# Altium project PCBLaser.PrjPCB
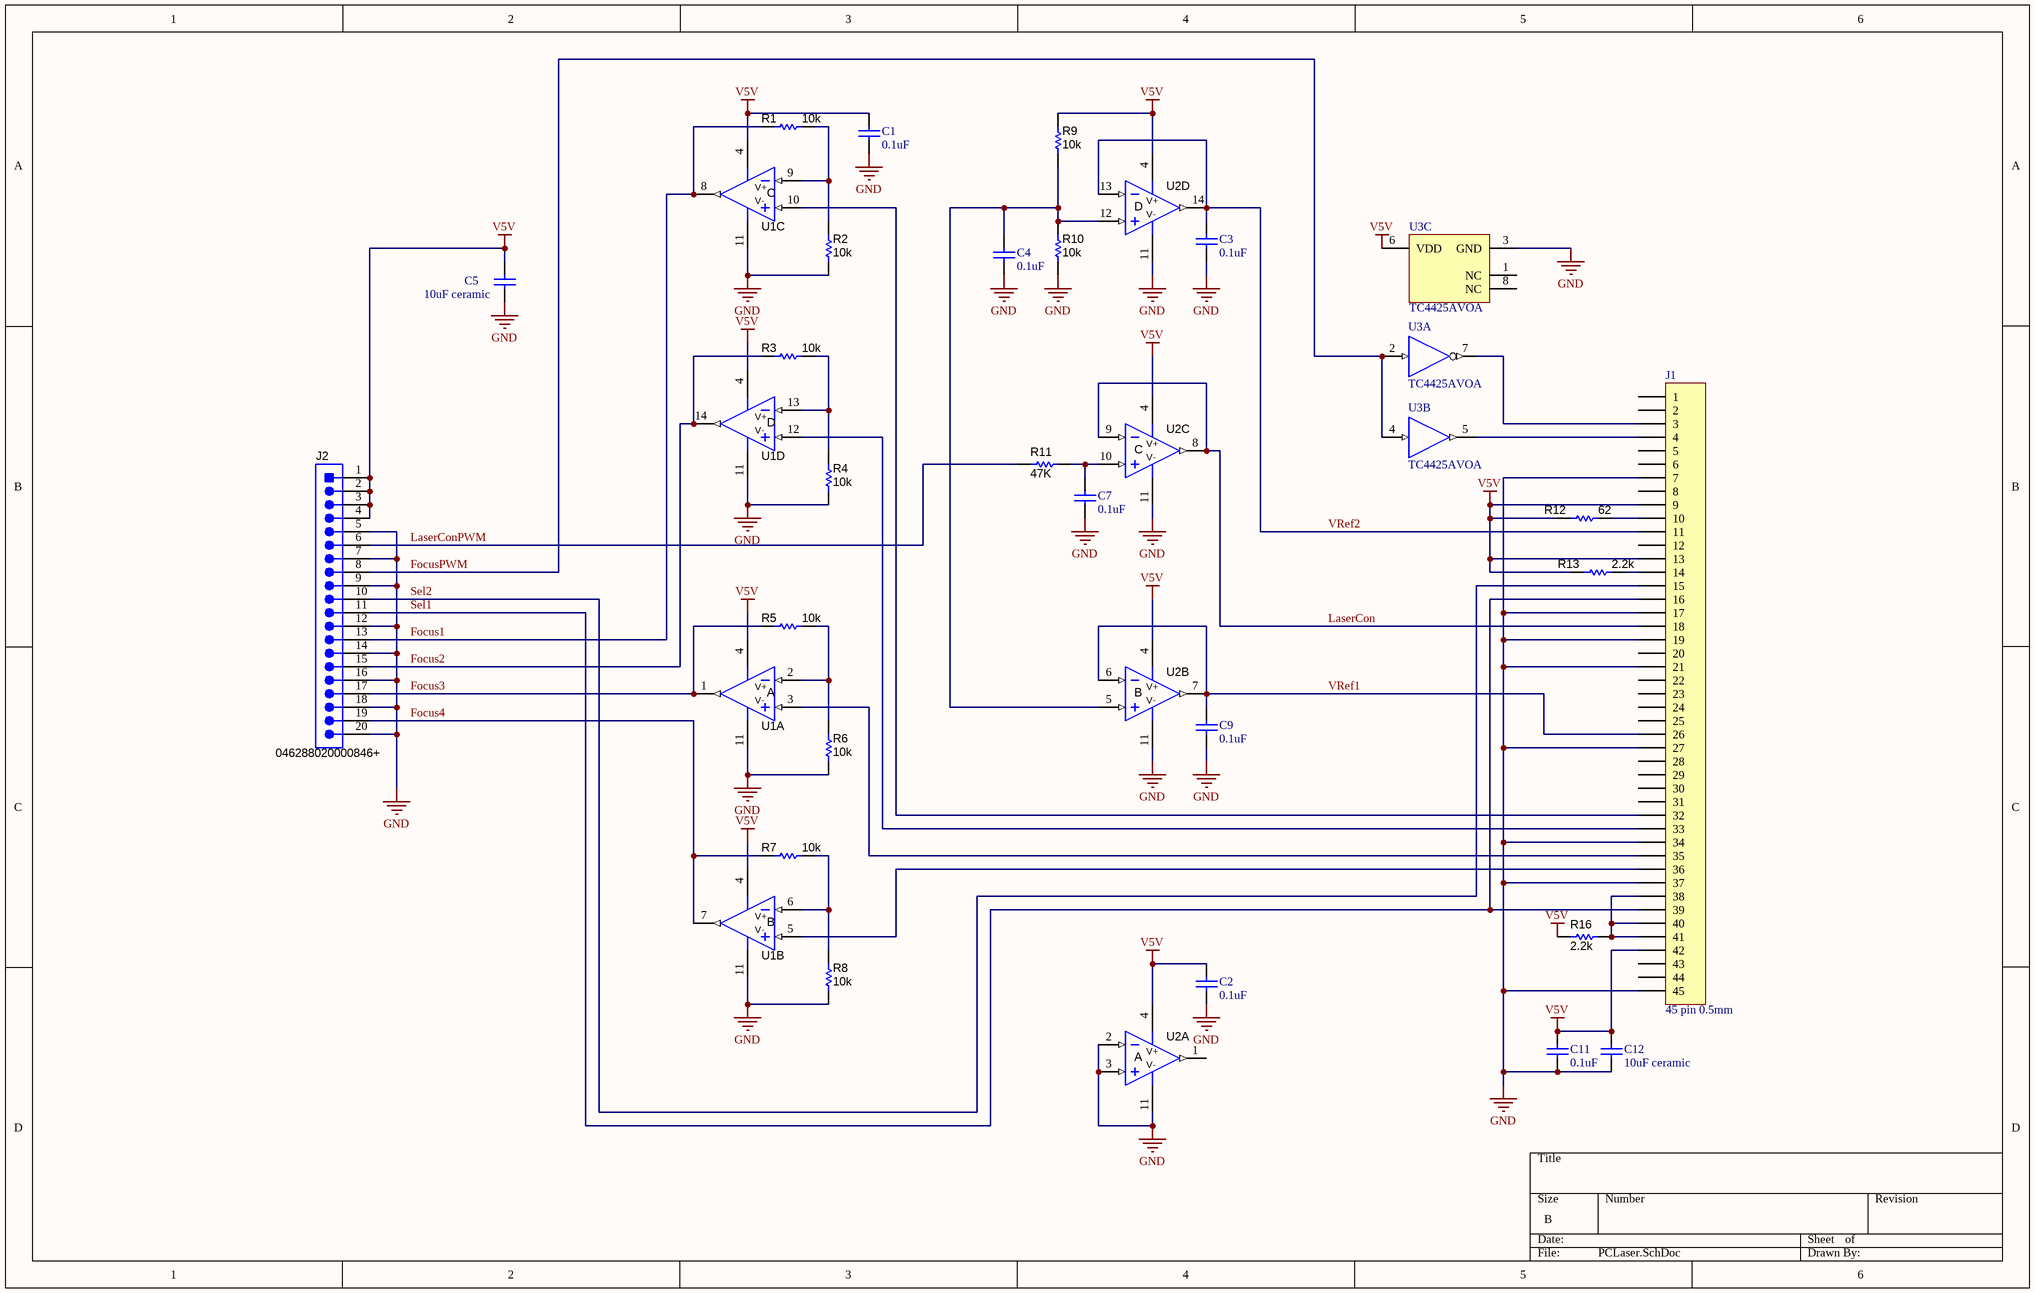
[diagram p0: PCLaser.SchDoc]
1 sheet, 28 parts. Net scope: global (net labels, ports and power ports of the same name join across sheets).
Board file: PCBLaser.PcbDoc

## Sheet PCLaser.SchDoc
size B

### Parts
C1  0.1uF  [0603c]
C2  0.1uF  [0603c]
C3  0.1uF  [0603c]
C4  0.1uF  [0603c]
C5  10uF ceramic  [0805C]
C7  0.1uF  [0603c]
C9  0.1uF  [0603c]
C11  0.1uF  [0603c]
C12  10uF ceramic  [0805C]
J1  45 pin 0.5mm  [FPC-45x0.5mm]
J2  046288020000846+  [FPC20-0.5mm]
R1  ValueDisplayed: 10k  [0603]  (hidden comment: CRCW060310K0JNEA)
R2  ValueDisplayed: 10k  [0603]  (hidden comment: CRCW060310K0JNEA)
R3  ValueDisplayed: 10k  [0603]  (hidden comment: CRCW060310K0JNEA)
R4  ValueDisplayed: 10k  [0603]  (hidden comment: CRCW060310K0JNEA)
R5  ValueDisplayed: 10k  [0603]  (hidden comment: CRCW060310K0JNEA)
R6  ValueDisplayed: 10k  [0603]  (hidden comment: CRCW060310K0JNEA)
R7  ValueDisplayed: 10k  [0603]  (hidden comment: CRCW060310K0JNEA)
R8  ValueDisplayed: 10k  [0603]  (hidden comment: CRCW060310K0JNEA)
R9  ValueDisplayed: 10k  [0603]  (hidden comment: CRCW060310K0JNEA)
R10  ValueDisplayed: 10k  [0603]  (hidden comment: CRCW060310K0JNEA)
R11  ValueDisplayed: 47K  [0603]
R12  ValueDisplayed: 62  [0603]  (hidden comment: CRCW060362R0JNEA)
R13  ValueDisplayed: 2.2k  [0603]  (hidden comment: CRCW06032K20JNEA)
R16  ValueDisplayed: 2.2k  [0603]  (hidden comment: CRCW06032K20JNEA)
U1  LM324KPW  [PW0014A_N]  (value not drawn)  (parts A,B,C,D of 4)
U2  LM324KPW  [PW0014A_N]  (value not drawn)  (parts A,B,C,D of 4)
U3  TC4425AVOA  [SOIC-OA8_N]  (parts A,B,C of 3)

### Nets
GND: C1.1 C2.1 C3.1 C4.1 C5.1 C7.1 C9.1 C11.1 C12.1 J1.7 J1.17 J1.19 J1.21 J1.27 J1.34 J1.37 J1.45 J2.5 J2.7 J2.9 J2.12 J2.14 J2.16 J2.18 J2.20 R2.1 R4.1 R6.1 R8.1 R10.1 U1.11(V-) U2.2(IN-) U2.3(IN+) U2.11(V-) U3.3(GND)
V5V: C1.2 C2.2 C5.2 C11.2 C12.2 J1.9 J1.13 J1.42 J2.1 J2.2 J2.3 J2.4 R9.2 R12.2 R13.2 R16.2 U1.4(V+) U2.4(V+) U3.6(VDD)
Focus1: J2.13 R1.2 U1.8(OUT)
Focus2: J2.15 R3.2 U1.14(OUT)
Focus3: J2.17 R5.2 U1.1(OUT)
Focus4: J2.19 R7.2 U1.7(OUT)
FocusPWM: J2.8 U3.2(INA) U3.4(INB)
LaserCon: J1.18 U2.8(OUT) U2.9(IN-)
LaserConPWM: J2.6 R11.2
Sel1: J1.16 J1.39 J2.11
Sel2: J1.15 J2.10
VRef1: C9.2 J1.26 U2.6(IN-) U2.7(OUT)
VRef2: C3.2 J1.11 U2.13(IN-) U2.14(OUT)
NetC4_2: C4.2 R9.1 R10.2 U2.5(IN+) U2.12(IN+)
NetC7_2: C7.2 R11.1 U2.10(IN+)
NetJ1_3: J1.3 U3.7(~{OUTA})
NetJ1_4: J1.4 U3.5(OUTB)
NetJ1_10: J1.10 R12.1
NetJ1_14: J1.14 R13.1
NetJ1_32: J1.32 U1.10(IN+)
NetJ1_33: J1.33 U1.12(IN+)
NetJ1_35: J1.35 U1.3(IN+)
NetJ1_36: J1.36 U1.5(IN+)
NetJ1_38: J1.38 J1.40 J1.41 R16.1
NetR1_1: R1.1 R2.2 U1.9(IN-)
NetR3_1: R3.1 R4.2 U1.13(IN-)
NetR5_1: R5.1 R6.2 U1.2(IN-)
NetR7_1: R7.1 R8.2 U1.6(IN-)

Not connected (* = marked no-connect by the designer): J1 1 2 5 6 8 12 20 22 23 24 25 28 29 30 31 43 44; U2 1(OUT); U3 1(NC) 8(NC)

### Notes on the sheet
- (in symbol LM324KPW, part A) A
- (in symbol LM324KPW, part B) B
- (in symbol LM324KPW, part C) C
- (in symbol LM324KPW, part D) D

### Library data of the parts
C1-C5 C7 C9 C11 C12 = Cap: Capacitor
  C1-C4 C7 C9 C11: Published: 8-Jun-2000; LatestRevisionDate: 17-Jul-2002; LatestRevisionNote: Re-released for DXP Platform.; PackageReference: RAD-0.3; Publisher: Altium Limited; PackageDescription: Radial Cap, Thru-Hole; 2 Leads; 0.3 in Pin Spacing; Value: 0.1uF
J1 = CON45: Connector
J2 = 046288020000846+: Connector, 20 Pos. 0.5mm R/A SMT Bottom Contact One-Touch Lock, SMT; Manufacturer: Kyocera; SymbolCreator: a0412235; SymbolVersion: 2013-12-22; PartNumber: 046288020000846+; PackageReference: Receptacle, 20 Pos, 0.5 mm RA SMT Bottom Contact One-Touch Lock; CompType: Connector; RoHS: Y; MountType: SMT; ComponentLink1Description: Datasheet URL; ComponentLink1URL: http://www.kyocera-connector.com/prdct/pdf/6288.pdf; Publisher: Texas Instruments; LatestRevisionDate: 2016-11-04; Supplier 1: Digi-Key; Supplier Part Number 1: 478-5459-1-ND; Supplier 2: Mouser; Supplier Part Number 2: 581-046288020000846+
R1-R10 = CRCW060310K0JNEA: RES, 10 k, 5%, 0.1 W, 0603; Manufacturer: Vishay-Dale; CompType: Resistor; Value: 10k; Res_ohm: 10000; Value_Code: 10k0; Tolerance_%: 5; Power_W: 0.1; Value2: 0.1W; VDC_V: 75; TempCo: 200 ppm/C; EIA_Code: E24; U/M: EA; SymbolVersion: 2009-05-29; PartNumber: CRCW060310K0JNEA; PackageReference: 0603; RoHS: Y; Value1: 5%; MountType: SMT; Technology: Thick Film; Published: 2008-06-26; Publisher: Texas Instruments; LatestRevisionDate: 2015-05-02; ComponentLink1Description: Datasheet link; ComponentLink1URL: http://www.vishay.com/docs/20035/dcrcwe3.pdf; Supplier 1: Digi-Key; Supplier Part Number 1: 541-10KGCT-ND; Supplier 2: Mouser; Supplier Part Number 2: 71-CRCW0603J-10K-E3; Supplier 3: Farnell; Supplier Part Number 3: 1469749
R11 = CRCW060310K0JNEA: RES, 47K, 1%, 0.1 W, 0603; Manufacturer: Vishay-Dale; CompType: Resistor; Res_ohm: 10000; Tolerance_%: 5; Power_W: 0.1; Value2: 0.1W; VDC_V: 75; TempCo: 200 ppm/C; EIA_Code: E24; U/M: EA; SymbolVersion: 2009-05-29; Value: 47K; PackageReference: 0603; RoHS: Y; Value_Code: 47K; Value1: 1%; MountType: SMT; Technology: Thick Film; Published: 2008-06-26; Publisher: Texas Instruments; LatestRevisionDate: 2015-05-02; ComponentLink1Description: Datasheet link; ComponentLink1URL: http://www.vishay.com/docs/20035/dcrcwe3.pdf; Supplier 1: Digi-Key; Supplier 2: Mouser; Supplier 3: Farnell
R12 = CRCW060362R0JNEA: RES, 62, 5%, 0.1 W, 0603; Manufacturer: Vishay-Dale; CompType: Resistor; Value: 62; Value_Code: 62R0; Tolerance_%: 5; Power_W: 0.1; Value2: 0.1W; VDC_V: 75; TempCo: 200 ppm/C; SizeArea_mm2: 1.28; SizeX_mm: 1.6; SizeY_mm: 0.8; SizeZ_mm: 1; EIA_Code: E24; U/M: EA; AEC Category: Q200; SymbolVersion: 2009-05-29; PartNumber: CRCW060362R0JNEA; PackageReference: 0603; RoHS: Y; Res_ohm: 62; Value1: 5%; MountType: SMT; Technology: Thick Film; Published: 2008-06-26; Publisher: Texas Instruments; LatestRevisionDate: 2016-11-02; ComponentLink1Description: Datasheet link; ComponentLink1URL: http://www.vishay.com/docs/20035/dcrcwe3.pdf; Supplier 1: Digi-Key; Supplier Part Number 1: 541-62GCT-ND; Supplier 2: Mouser; Supplier Part Number 2: 71-CRCW0603J-62-E3; Supplier 3: Farnell; Supplier Part Number 3: 1570761; AEC Qualified: ?
R13 R16 = CRCW06032K20JNEA: RES, 2.2 k, 5%, 0.1 W, 0603; Manufacturer: Vishay-Dale; CompType: Resistor; Value: 2.2k; Res_ohm: 2200; Value_Code: 2k20; Tolerance_%: 5; Power_W: 0.1; Value2: 0.1W; VDC_V: 75; TempCo: 200 ppm/C; SizeArea_mm2: 1.28; SizeX_mm: 1.6; SizeY_mm: 0.8; SizeZ_mm: 1; EIA_Code: E24; U/M: EA; AEC Category: Q200; SymbolVersion: 2009-05-29; PartNumber: CRCW06032K20JNEA; PackageReference: 0603; RoHS: Y; Value1: 5%; MountType: SMT; Technology: Thick Film; Published: 2008-06-26; Publisher: Texas Instruments; LatestRevisionDate: 2016-11-02; ComponentLink1Description: Datasheet link; ComponentLink1URL: http://www.vishay.com/docs/20035/dcrcwe3.pdf; Supplier 1: Digi-Key; Supplier Part Number 1: 541-2.2KGCT-ND; Supplier 2: Farnell; Supplier Part Number 2: 1652868; Supplier 3: Newark; Supplier Part Number 3: 59M6776; AEC Qualified: ?
U1 U2 = LM324KPW: Quad Low Power Op Amp with 2KV ESD protection, PW0014A; Manufacturer: Texas Instruments; SymbolCreator: a0412235; CompType: OpAmp IC; SymbolVersion: 2015-01-09; PartNumber: LM324KPW; PackageReference: PW0014A; MountType: SMT; Publisher: Texas Instruments; LatestRevisionDate: 2016-06-02; Alternate Manufacturer: Texas Instruments; ComponentLink1Description: LM324K Datasheet; ComponentLink1URL: http://www.ti.com/lit/gpn/LM324; ComponentLink2Description: LM324K Web Page; ComponentLink2URL: http://www.ti.com/product/LM324K; ComponentLink3Description: TSSOP Package Web Page; ComponentLink3URL: http://www.ti.com/sc/docs/psheets/type/tssop.html
U3 = TC4425AVOA: 3A Dual High-Speed Power MOSFET Drivers, Complimentary, Extended Temperature; Published: 29-Jan-2009; DatasheetVersion: revB, Apr-2007; PackageVersion: revBB, Aug-2009; PackageReference: SOIC-OA8; Publisher: Altium Limited; PackageDescription: 8-Lead Plastic Small Outline (OA) - Narrow, 3.90mm Body [SOIC]; Supplier 1: Digi-Key; Supplier Part Number 1: TC4425AVOA-ND; Supplier 2: Farnell; Supplier Part Number 2: 1834904; Code_IPC: SOIC127P600-8; ComponentLink1Description: Datasheet; ComponentLink1URL: http://ww1.microchip.com/downloads/en/DeviceDoc/21998b.pdf; ComponentLink2Description: Packaging Specification; ComponentLink2URL: http://www.microchip.com/stellent/groups/techpub_sg/documents/packagingspec/en012702.pdf; ComponentLink3Description: Microchip.com Home; ComponentLink3URL: http://www.microchip.com/